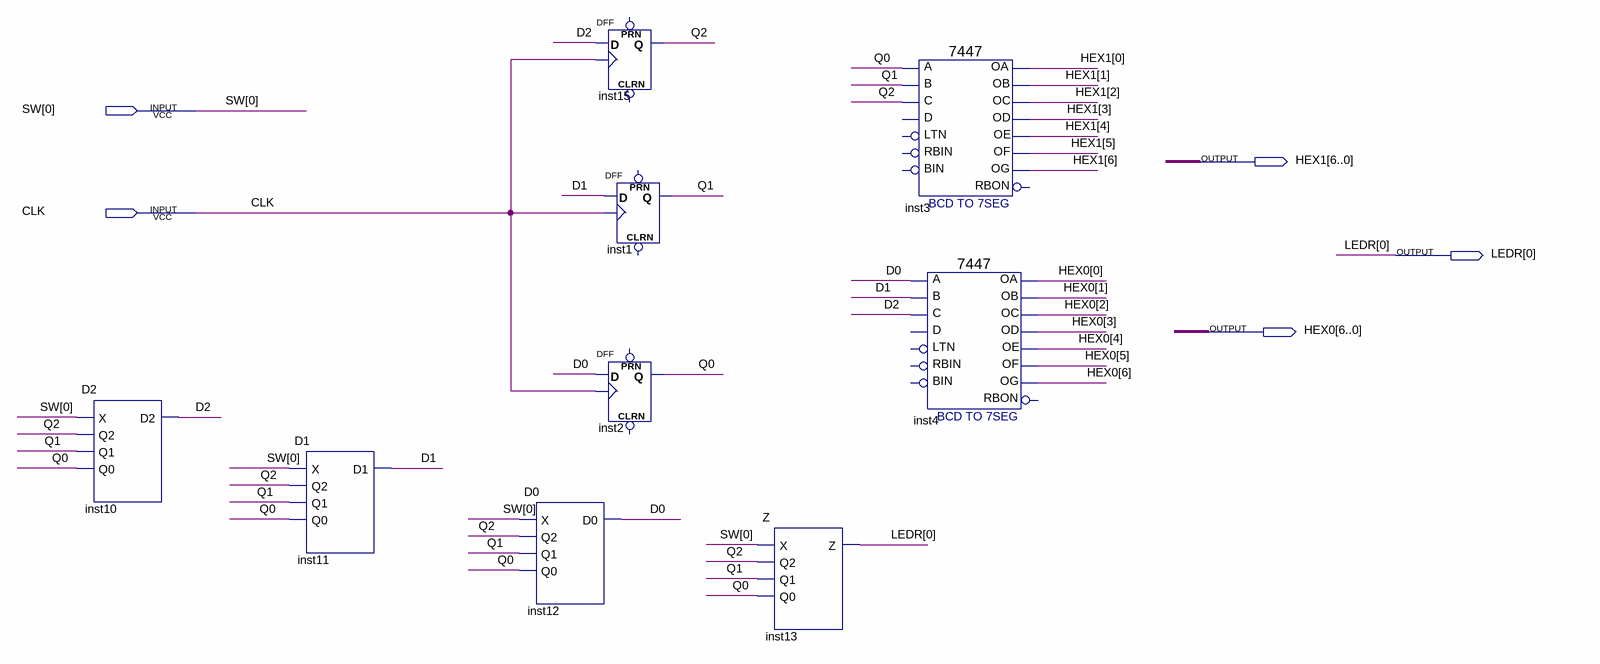
[diagram p0: schematic sheet]
// Quartus schematic 22521154_Moore.bdf as structural Verilog: 9 symbols, 5 pins
module \22521154_Moore  (
  input  [0:0] SW,
  input  CLK,
  output [6:0] HEX1,
  output [0:0] LEDR,
  output [6:0] HEX0
);

  wire D0, D1, D2, Q0, Q1, Q2;

  D2 inst10 (.X(SW[0]), .Q2(Q2), .Q1(Q1), .Q0(Q0), .D2(D2));
  D1 inst11 (.X(SW[0]), .Q2(Q2), .Q1(Q1), .Q0(Q0), .D1(D1));
  D0 inst12 (.X(SW[0]), .Q2(Q2), .Q1(Q1), .Q0(Q0), .D0(D0));
  DFF inst15 (.CLK(CLK), .D(D2), .Q(Q2));  // open: CLRN, PRN
  DFF inst1 (.CLK(CLK), .D(D1), .Q(Q1));  // open: CLRN, PRN
  DFF inst2 (.CLK(CLK), .D(D0), .Q(Q0));  // open: CLRN, PRN
  Z inst13 (.X(SW[0]), .Q2(Q2), .Q1(Q1), .Q0(Q0), .Z(LEDR[0]));
  \7447  inst3 (
    .B(Q1), .C(Q2), .A(Q0), .OB(HEX1[1]), .OC(HEX1[2]), .OE(HEX1[4]), .OD(HEX1[3]), .OF(HEX1[5]),
    .OG(HEX1[6]), .OA(HEX1[0]));  // open: LTN, D, RBIN, BIN, RBON
  \7447  inst4 (
    .B(D1), .C(D2), .A(D0), .OB(HEX0[1]), .OC(HEX0[2]), .OE(HEX0[4]), .OD(HEX0[3]), .OF(HEX0[5]),
    .OG(HEX0[6]), .OA(HEX0[0]));  // open: LTN, D, RBIN, BIN, RBON
endmodule
